# EAGLE design Proj2 (EAGLE 9.6.2)
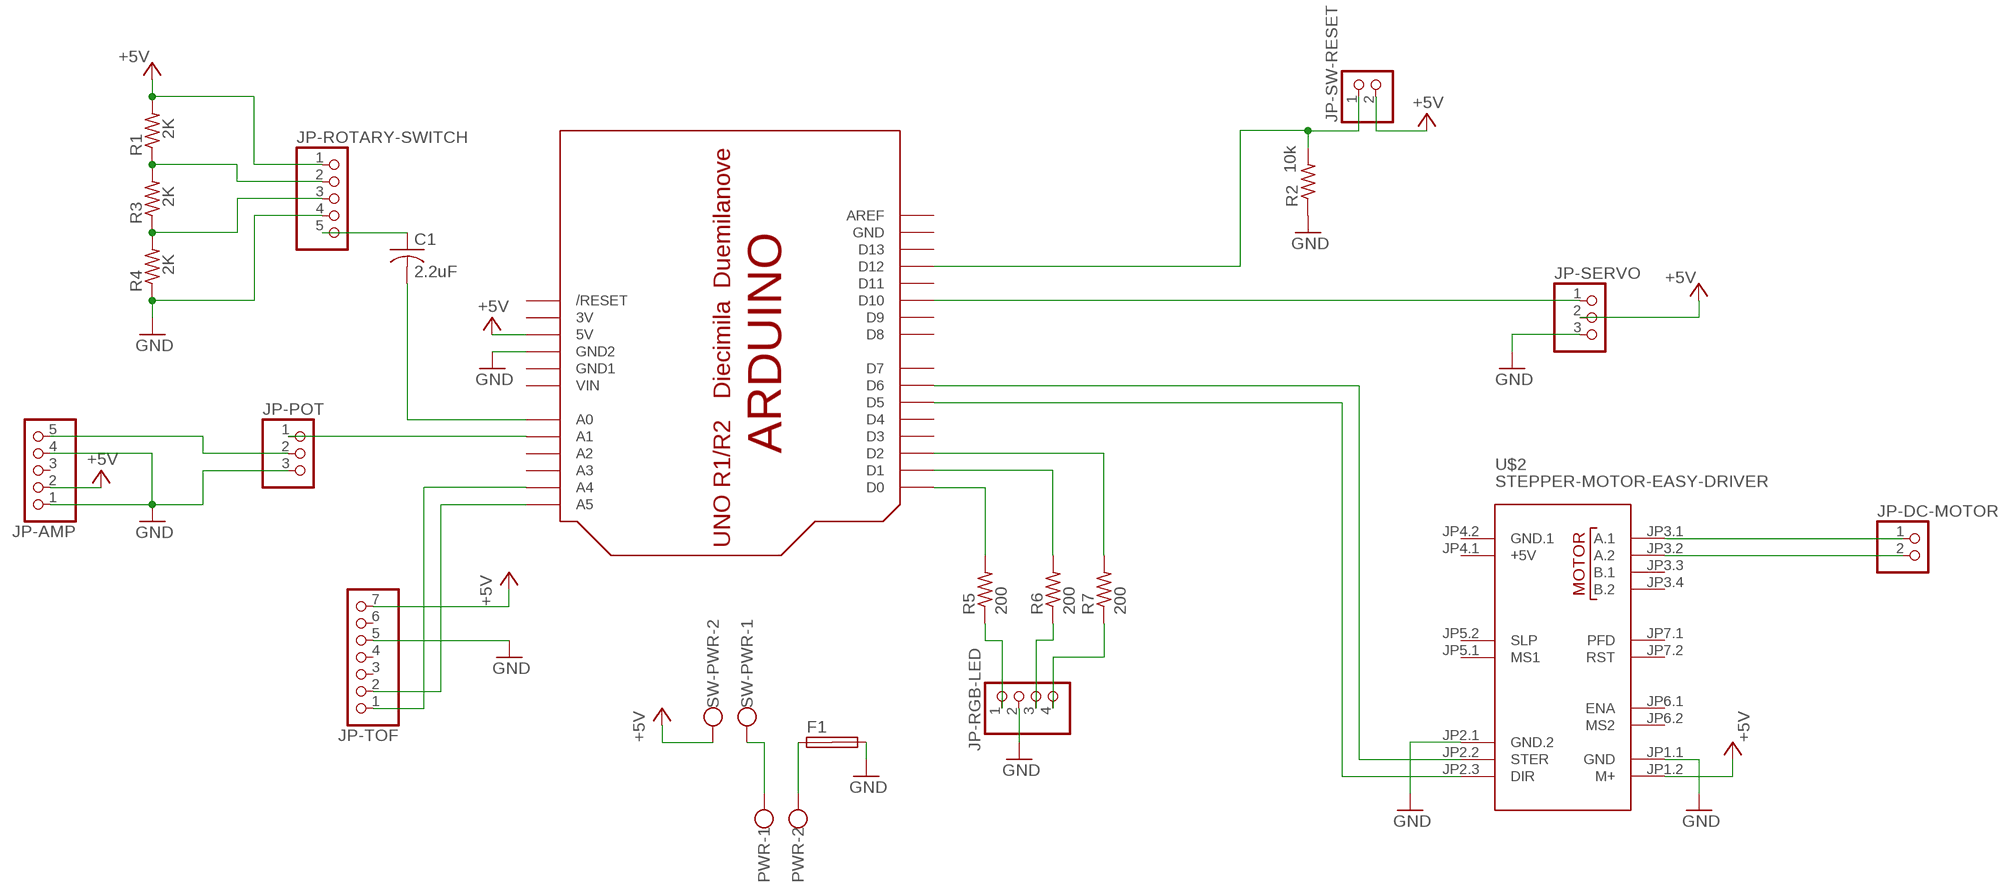
[diagram p0: schematic, sheet 1]

## Parts
C1  2.2uF  C-US050-024X044  [C050-024X044]
F1  SH32  [SH32]
JP-AMP  PINHD-1X5  [1X05]
JP-DC-MOTOR  PINHD-1X2  [1X02]
JP-POT  PINHD-1X3  [1X03]
JP-RGB-LED  PINHD-1X4  [1X04]
JP-ROTARY-SWITCH  PINHD-1X5  [1X05]
JP-SERVO  PINHD-1X3  [1X03]
JP-SW-RESET  PINHD-1X2  [1X02]
JP-TOF  PINHD-1X7  [1X07]
PWR  W237-102  [W237-102]
R1  2K  R-US_0207/7  [0207/7]
R2  10k  R-US_0207/7  [0207/7]
R3  2K  R-US_0207/7  [0207/7]
R4  2K  R-US_0207/7  [0207/7]
R5  200  R-US_0207/7  [0207/7]
R6  200  R-US_0207/7  [0207/7]
R7  200  R-US_0207/7  [0207/7]
SW-PWR  W237-102  [W237-102]
U$1  ARDUINO-NOHOLE  [ARDUINO-NOHOLE]
U$2  STEPPER-MOTOR-EASY-DRIVER  [STEPPER-MOTOR-EASY-DRIVER]

## Nets
+5V: JP-AMP.2 JP-ROTARY-SWITCH.1 JP-SERVO.2 JP-SW-RESET.2 JP-TOF.7 R1.2 SW-PWR.2 U$1.5V U$2.JP1.2(M+)
GND: F1.2A JP-AMP.1 JP-AMP.4 JP-POT.3 JP-RGB-LED.2 JP-ROTARY-SWITCH.4 JP-SERVO.3 JP-TOF.5 R2.1 R4.1 U$1.GND2 U$2.JP1.1(GND) U$2.JP2.1(GND.2)
N$1: JP-TOF.1 U$1.A4
N$2: JP-TOF.2 U$1.A5
N$3: PWR.1 SW-PWR.1
N$4: JP-RGB-LED.1 R5.1
N$5: F1.1A PWR.2
N$6: C1.1 JP-ROTARY-SWITCH.5
N$7: R5.2 U$1.D0
N$8: JP-SERVO.1 U$1.D10
N$9: JP-RGB-LED.3 R6.1
N$10: R6.2 U$1.D1
N$11: R7.2 U$1.D2
N$12: U$1.D5 U$2.JP2.3(DIR)
N$13: JP-POT.1 U$1.A1
N$14: JP-SW-RESET.1 R2.2 U$1.D12
N$15: JP-RGB-LED.4 R7.1
N$16: C1.2 U$1.A0
N$17: JP-AMP.5 JP-POT.2
N$19: JP-ROTARY-SWITCH.2 R1.1 R3.2
N$20: JP-ROTARY-SWITCH.3 R3.1 R4.2
N$21: U$1.D6 U$2.JP2.2(STER)
N$24: JP-DC-MOTOR.2 U$2.JP3.2(A.2)
N$25: JP-DC-MOTOR.1 U$2.JP3.1(A.1)
Unconnected: F1.1B F1.2B JP-AMP.3 JP-TOF.3 JP-TOF.4 JP-TOF.6 U$1.A2 U$1.A3 U$1.AREF U$1.D3 U$1.D4 U$1.D7 U$1.D8 U$1.D9 U$1.D11 U$1.D13 U$1.RESET(/RESET) U$2.JP3.3(B.1) U$2.JP3.4(B.2) U$2.JP4.1(+5V) U$2.JP4.2(GND.1) U$2.JP5.1(MS1) U$2.JP5.2(SLP) U$2.JP6.1(ENA) U$2.JP6.2(MS2) U$2.JP7.1(PFD) U$2.JP7.2(RST)

## Power pins joined to a net without a drawn wire
3V: U$1.3V
GND: U$1.GND
GND1: U$1.GND1
VIN: U$1.VIN

## Library data of the parts
C1 = rcl:C-US: CAPACITOR, American symbol; SPICEPREFIX: C
F1 = fuse:SH32: FUSE HOLDER 6 x 32 mm, SH contact, SHH3N Schukat, 102071 Wickmann (Buerklin); MPN: 10207101009; OC_FARNELL: 811786; OC_NEWARK: 76R6904
JP-AMP JP-ROTARY-SWITCH = pinhead:PINHD-1X5: PIN HEADER
JP-DC-MOTOR JP-SW-RESET = pinhead:PINHD-1X2: PIN HEADER
JP-POT JP-SERVO = pinhead:PINHD-1X3: PIN HEADER
JP-RGB-LED = pinhead:PINHD-1X4: PIN HEADER
JP-TOF = pinhead:PINHD-1X7: PIN HEADER
PWR SW-PWR = con-wago-500:W237-102: WAGO SCREW CLAMP; MPN: 237-102; OC_FARNELL: unknown; OC_NEWARK: 70K9898
R1-R7 = adafruit:R-US_: RESISTOR, American symbol
U$1 = adafruit:ARDUINO: Arduino Diecimila/Duemilanove Make a shield with ease, this package has all the named pins as well as the two mounting drill holes and an outline of the USB and DC power connector. The outline is on the DIMENSION layer, so if your board house uses it they will cut the outline to match. http://www.ladyada.net/library/pcb/eaglelibrary.html
U$2 = diy-modules:STEPPER-MOTOR-EASY-DRIVER: Stepper Motor Easy Driver Project page: http://www.schmalzhaus.com/EasyDriver/ Click here to find device on ebay.com <http://www.ebay.com/sch/easydriver+stepper+motor+driver>

## Board
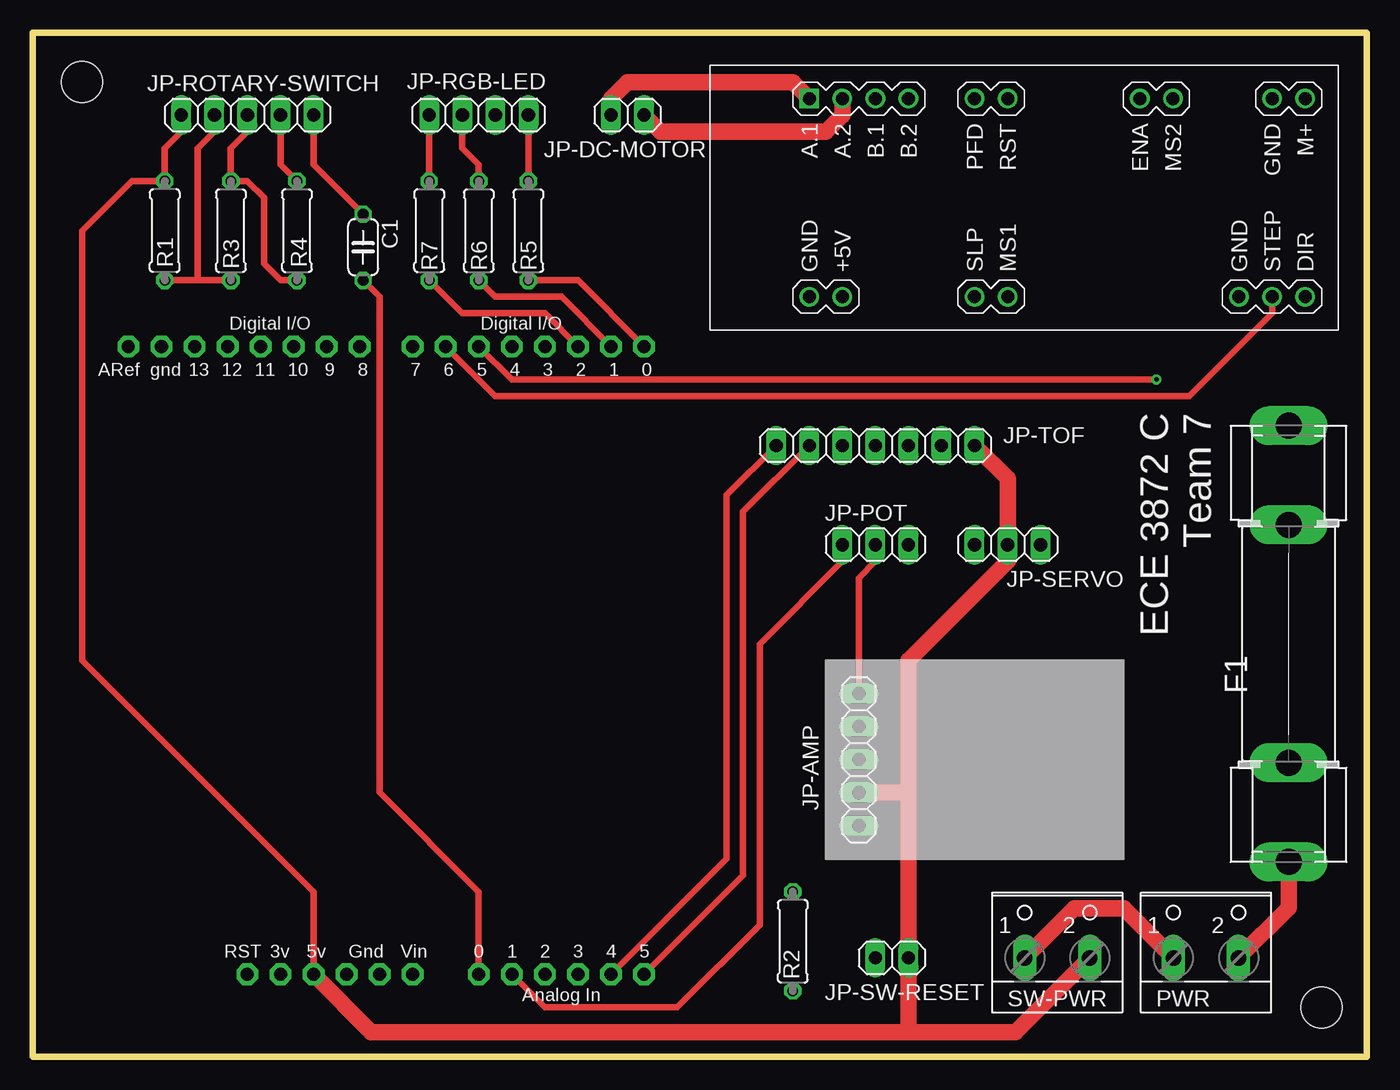
[diagram p1: board, top side]
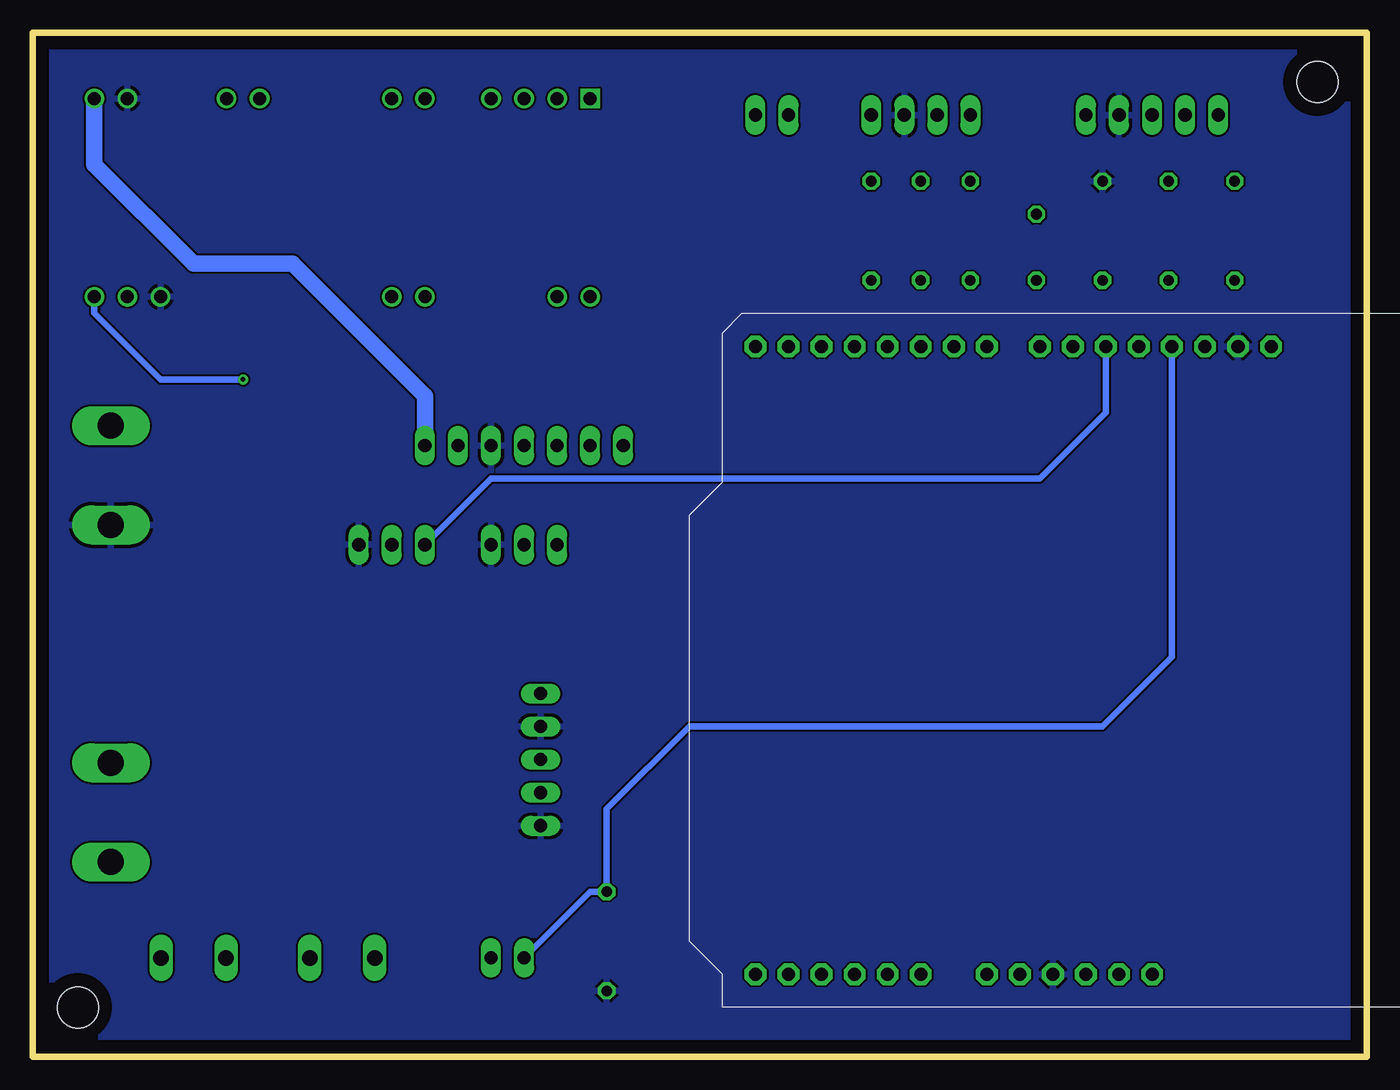
[diagram p2: board, bottom side, seen from below]

Size 102.54 x 78.73 mm. Coordinates in mm from the lower left corner, seen from the top.
Outline: 0,0 102.54,0 102.54,78.73 0,78.73 0,0
Copper layers (1*16): Top 0.035mm / dielectric 1.5mm / Bottom 0.035mm
Design rules "default": minimum track width 6mil, minimum drill 0.35mm, track to track 6mil, track to pad 6mil, pad to pad 6mil, via to via 6mil, smd to smd 6mil, copper to edge 40mil, drill to drill 6mil, minimum pad ring 10mil, minimum via ring 8mil, stop-mask expansion 4mil, vias tented up to drill 0mil, thermal gap 10mil
Holes 3.17 mm at 3.81,74.93 99.06,3.81

### Footprints (pad centres in the part's own frame; a part is rotated, then mirrored left to right if it is on the bottom)
C050-024X044 = drill 0.813 octagon: 1 -2.54,0; 2 2.54,0
SH32 = drill 2.007 long: 1A -16.764,0; 1B -9.144,0; 2A 9.144,0; 2B 16.764,0
1X05 = drill 1.016 long: 1 -5.08,0; 2 -2.54,0; 3 0,0; 4 2.54,0; 5 5.08,0
1X02 = drill 1.016 long: 1 -1.27,0; 2 1.27,0
1X03 = drill 1.016 long: 1 -2.54,0; 2 0,0; 3 2.54,0
1X04 = drill 1.016 long: 1 -3.81,0; 2 -1.27,0; 3 1.27,0; 4 3.81,0
1X07 = drill 1.016 long: 1 -7.62,0; 2 -5.08,0; 3 -2.54,0; 4 0,0; 5 2.54,0; 6 5.08,0; 7 7.62,0
W237-102 = drill 1.194 long: 1 -2.5,-1.27; 2 2.5,-1.27
0207/7 = drill 0.813 octagon: 1 -3.81,0; 2 3.81,0
ARDUINO-NOHOLE = drill 1 pad 1.676 octagon: 3V 35.56,2.54; 5V 38.1,2.54; A0 50.8,2.54; A1 53.34,2.54; A2 55.88,2.54; A3 58.42,2.54; A4 60.96,2.54; A5 63.5,2.54; AREF 23.876,50.8; D0 63.5,50.8; D1 60.96,50.8; D2 58.42,50.8; D3 55.88,50.8; D4 53.34,50.8; D5 50.8,50.8; D6 48.26,50.8; D7 45.72,50.8; D8 41.656,50.8; D9 39.116,50.8; D10 36.576,50.8; D11 34.036,50.8; D12 31.496,50.8; D13 28.956,50.8; GND 26.416,50.8; GND1 43.18,2.54; GND2 40.64,2.54; RESET 33.02,2.54; VIN 45.72,2.54
STEPPER-MOTOR-EASY-DRIVER = drill 1: JP1.1 19.05,7.62; JP1.2 21.59,7.62; JP2.1 16.51,-7.62; JP2.2 19.05,-7.62; JP2.3 21.59,-7.62; JP3.2 -13.97,7.62; JP3.3 -11.43,7.62; JP3.4 -8.89,7.62; JP4.1 -13.97,-7.62; JP4.2 -16.51,-7.62; JP5.1 -1.27,-7.62; JP5.2 -3.81,-7.62; JP6.1 8.89,7.62; JP6.2 11.43,7.62; JP7.1 -3.81,7.62; JP7.2 -1.27,7.62 | drill 1 square: JP3.1 -16.51,7.62

### Placement (x,y rotation side)
C1  25.4,62.23 270 top
F1  96.52,31.75 90 top
JP-AMP  63.5,22.86 90 top
JP-DC-MOTOR  45.72,72.39 0 top
JP-POT  64.77,39.37 0 top
JP-RGB-LED  34.29,72.39 180 top
JP-ROTARY-SWITCH  16.51,72.39 0 top
JP-SERVO  74.93,39.37 0 top
JP-SW-RESET  66.04,7.62 0 top
JP-TOF  64.77,46.99 0 top
PWR  90.17,8.89 0 top
R1  10.16,63.5 90 top
R2  58.42,8.89 90 top
R3  15.24,63.5 270 top
R4  20.32,63.5 270 top
R5  38.1,63.5 270 top
R6  34.29,63.5 270 top
R7  30.48,63.5 270 top
SW-PWR  78.74,8.89 0 top
U$1  -16.51,3.81 0 top
U$2  76.2,66.04 0 top

### Tracks (layer width: path | path; a pad name or v marks a point on that pad's centre or on a via)
+5V
  Top 0.508: JP-ROTARY-SWITCH.1 11.43,71.12 10.16,69.85 R1.2 7.62,67.31 3.81,63.5 3.81,30.48 21.59,12.7 U$1.5V
  Top 1.27: U$1.5V 26.04,1.91 67.31,1.91 | SW-PWR.2 75.53,1.91 67.31,1.91 | 67.31,1.91 JP-SW-RESET.2 67.31,20.32 | JP-AMP.2 67.31,20.32 | 67.31,20.32 67.31,30.48 74.93,38.1 JP-SERVO.2 74.93,44.45 JP-TOF.7
  Bottom 1.27: JP-TOF.7 72.39,50.8 82.55,60.96 90.17,60.96 97.79,68.58 U$2.JP1.2
GND
  Top 0.508: JP-ROTARY-SWITCH.4 19.05,68.58 R4.1
  pour Bottom: -1.27,80.01 104.14,80.01 104.14,-2.54 -2.54,-2.54 -2.54,80.01
N$1
  Top 0.508: JP-TOF.1 53.34,43.18 53.34,15.24 U$1.A4
N$2
  Top 0.508: U$1.A5 54.61,13.97 54.61,41.91 JP-TOF.2
N$3
  Top 1.27: SW-PWR.1 80.05,11.43 83.86,11.43 PWR.1
N$4
  Top 0.508: JP-RGB-LED.1 R5.1
N$5
  Top 1.27: F1.1A 96.52,11.47 PWR.2
N$6
  Top 0.508: C1.1 21.59,68.58 JP-ROTARY-SWITCH.5
N$7
  Top 0.508: R5.2 41.91,59.69 U$1.D0
N$8
  Bottom 0.508: U$1.D10 20.07,49.53 25.15,44.45 67.31,44.45 JP-SERVO.1
N$9
  Top 0.508: JP-RGB-LED.3 33.02,69.85 34.29,68.58 R6.1
N$10
  Top 0.508: R6.2 35.56,58.42 40.64,58.42 U$1.D1
N$11
  Top 0.508: R7.2 33.02,57.15 39.37,57.15 U$1.D2
N$12  (via drill 0.35)
  Top 0.508: U$1.D5 36.83,52.07 v86.36,52.07
  Bottom 0.508: v86.36,52.07 92.71,52.07 97.79,57.15 U$2.JP2.3
N$13
  Top 0.508: U$1.A1 39.37,3.81 49.53,3.81 55.88,10.16 55.88,31.75 62.23,38.1 JP-POT.1
N$14
  Bottom 0.508: JP-SW-RESET.1 59.69,12.7 R2.2 58.42,19.05 52.07,25.4 20.32,25.4 14.99,30.73 U$1.D12
N$15
  Top 0.508: JP-RGB-LED.4 R7.1
N$16
  Top 0.508: C1.2 26.67,58.42 26.67,20.32 34.29,12.7 U$1.A0
N$17
  Top 0.508: JP-POT.2 64.77,38.1 63.5,36.83 JP-AMP.5
N$19
  Top 0.508: R3.2 12.7,59.69 | 12.7,59.69 R1.1 | JP-ROTARY-SWITCH.2 13.97,71.12 12.7,69.85 12.7,59.69
N$20
  Top 0.508: JP-ROTARY-SWITCH.3 16.51,71.12 15.24,69.85 R3.1 16.51,67.31 17.78,66.04 17.78,60.96 19.05,59.69 R4.2
N$21
  Top 0.508: U$1.D6 35.56,50.8 88.9,50.8 95.25,57.15 U$2.JP2.2
N$24
  Top 1.27: JP-DC-MOTOR.2 48.26,71.12 60.96,71.12 62.23,72.39 U$2.JP3.2
N$25
  Top 1.27: JP-DC-MOTOR.1 44.45,73.66 45.72,74.93 58.42,74.93 U$2.JP3.1

### Text on the board
tNames: ECE 3872 C / Team 7